# Altium schematic sheet P08.ExtConn.SchDoc
size A4
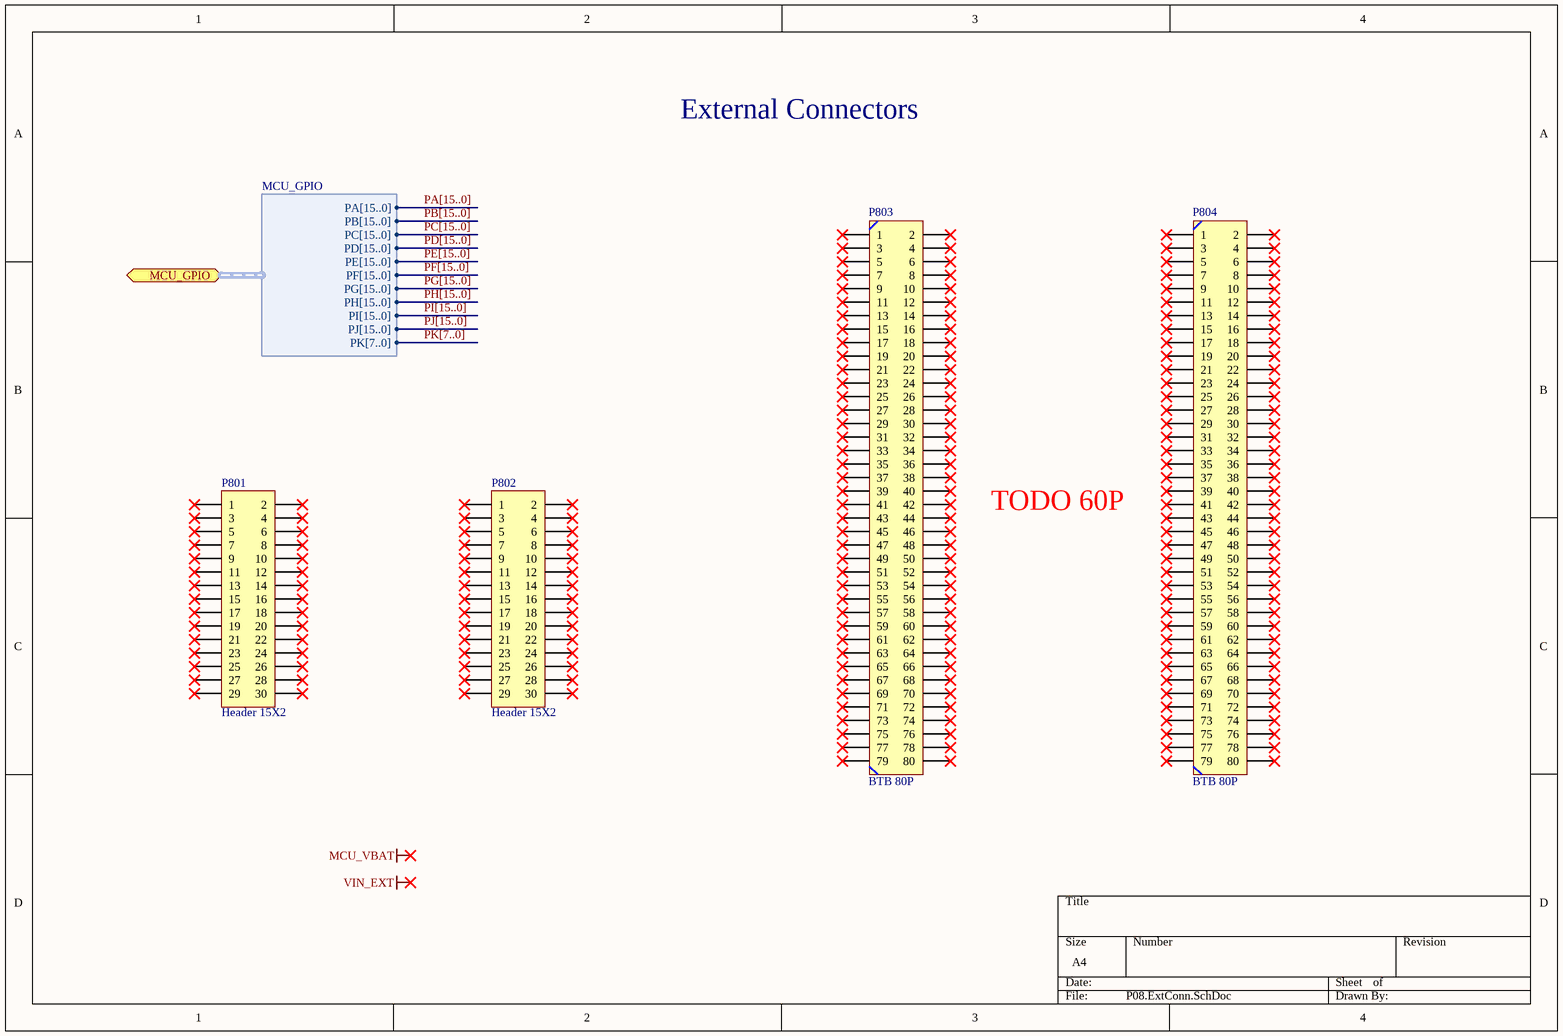
[diagram p0: P08.ExtConn.SchDoc]

## Parts
P801  Header 15X2  [HDR2X15]
P802  Header 15X2  [HDR2X15]
P803  BTB 80P  [BTB-0.8mm-80P-F]
P804  BTB 80P  [BTB-0.8mm-80P-F]

## Ports
MCU_GPIO (bidir, harness MCU_GPIO)

## Harnesses
MCU_GPIO: PA[15..0], PB[15..0], PC[15..0], PD[15..0], PE[15..0], PF[15..0], PG[15..0], PH[15..0], PI[15..0], PJ[15..0], PK[7..0]

## Nets

Not connected (* = marked no-connect by the designer): P801 1* 2* 3* 4* 5* 6* 7* 8* 9* 10* 11* 12* 13* 14* 15* 16* 17* 18* 19* 20* 21* 22* 23* 24* 25* 26* 27* 28* 29* 30*; P802 1* 2* 3* 4* 5* 6* 7* 8* 9* 10* 11* 12* 13* 14* 15* 16* 17* 18* 19* 20* 21* 22* 23* 24* 25* 26* 27* 28* 29* 30*; P803 1* 2* 3* 4* 5* 6* 7* 8* 9* 10* 11* 12* 13* 14* 15* 16* 17* 18* 19* 20* 21* 22* 23* 24* 25* 26* 27* 28* 29* 30* 31* 32* 33* 34* 35* 36* 37* 38* 39* 40* 41* 42* 43* 44* 45* 46* 47* 48* 49* 50* 51* 52* 53* 54* 55* 56* 57* 58* 59* 60* 61* 62* 63* 64* 65* 66* 67* 68* 69* 70* 71* 72* 73* 74* 75* 76* 77* 78* 79* 80*; P804 1* 2* 3* 4* 5* 6* 7* 8* 9* 10* 11* 12* 13* 14* 15* 16* 17* 18* 19* 20* 21* 22* 23* 24* 25* 26* 27* 28* 29* 30* 31* 32* 33* 34* 35* 36* 37* 38* 39* 40* 41* 42* 43* 44* 45* 46* 47* 48* 49* 50* 51* 52* 53* 54* 55* 56* 57* 58* 59* 60* 61* 62* 63* 64* 65* 66* 67* 68* 69* 70* 71* 72* 73* 74* 75* 76* 77* 78* 79* 80*

## Buses and harness runs
bus PA[15..0]
bus PB[15..0]
bus PC[15..0]
bus PD[15..0]
bus PE[15..0]
bus PF[15..0]
bus PG[15..0]
bus PH[15..0]
bus PI[15..0]
bus PJ[15..0]
bus PK[7..0]

## Notes on the sheet
- External Connectors
- TODO 60P
- Labels drawn without touching a wire or pin: MCU_VBAT, VIN_EXT

## Library data of the parts
P801 P802 = Header 15X2: Header, 15-Pin, Dual row; LatestRevisionDate: 17-Jul-2002; LatestRevisionNote: Re-released for DXP Platform.; Publisher: Altium Limited
P803 P804 = CON BTB 80P: Free Height, PCB Mount Receptacle, Vertical, Board-to-Board, 80 Position, .8mm [.031in] Centerline, Gold, Printed Circuit Board; LatestRevisionDate: 17-Jul-2002; LatestRevisionNote: Re-released for DXP Platform.; Publisher: Altium Limited